# EAGLE design influencair (EAGLE 9.0.1)
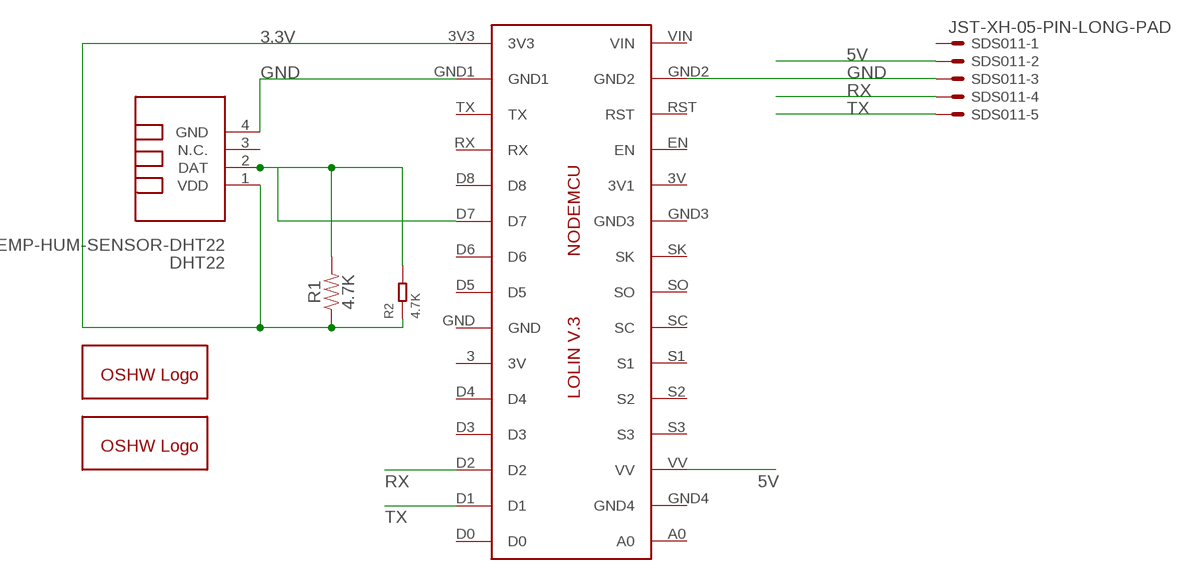
[diagram p0: schematic, sheet 1]

## Parts
DHT22  TEMP-HUM-SENSOR-DHT22  [TEMP-HUM-SENSOR-DHT22]
GOLD_ORB_SM1  OSHWLOGOLOGO8MM  [OSHW_8MM]
GOLD_ORB_SM2  OSHWLOGOLOGO8MM  [OSHW_8MM]
IC1  LOLINV3  [LOLINV3]
R1  4.7K  1MOHM-HORIZ-1/4W-5%  [AXIAL-0.3]
R2  4.7K  SMD-RES-4.7K-5%-1/8W(0805)  [R0805]
SDS011  JST-XH-05-PIN-LONG-PAD  [JST-XH-05-PACKAGE-LONG-PAD]

## Nets
3.3V: DHT22.1(VDD) IC1.3V3 R1.P$1 R2.1
5V: IC1.VV SDS011.2
GND: DHT22.4(GND) IC1.GND1 SDS011.3
N$3: DHT22.2(DAT) IC1.D7 R1.P$2 R2.2
N$4: IC1.GND2
RX: IC1.D2 SDS011.4
TX: IC1.D1 SDS011.5
Unconnected: DHT22.3(N.C.) IC1.3(3V) IC1.3V(3V1) IC1.A0 IC1.D0 IC1.D3 IC1.D4 IC1.D5 IC1.D6 IC1.D8 IC1.EN IC1.GND IC1.GND3 IC1.GND4 IC1.RST IC1.RX IC1.S1 IC1.S2 IC1.S3 IC1.SC IC1.SK IC1.SO IC1.TX IC1.VIN SDS011.1

## Library data of the parts
DHT22 = diy-modules:TEMP-HUM-SENSOR-DHT22: DHT22 - digital humidity & temperature sensor Also known as: AM2302 AM2302 datasheet available here: http://akizukidenshi.com/download/ds/aosong/AM2302.pdf Click here to find device on ebay.com <http://www.ebay.com/sch/dht22+digital+sensor>
GOLD_ORB_SM1 GOLD_ORB_SM2 = oshw:OSHWLOGO: The OSHW logo for PCB layout
IC1 = Lolin:LOLINV3
R1 = SparkFun-Resistors:1MOHM: 1MΩ resistor A resistor is a passive two-terminal electrical component that implements electrical resistance as a circuit element. Resistors act to reduce current flow, and, at the same time, act to lower voltage levels within circuits. - Wikipedia; PROD_ID: RES-09329; VALUE: 1M
R2 = Seeed-Resistor:SMD-RES-4.7K-5%-1/8W(0805): 301010306; MPN: RC0805JR-074K7L
SDS011 = Rembrandt Electronics - JST XH Connectors v1-0:JST-XH-05-PIN: JST XH Connector 2 Pin Wire to board connector. Pitch: 2,54 mm, (0.100") Number of pins: 5 Created by Rembrandt Electronics www.rembrandtelectronics.com

## Board
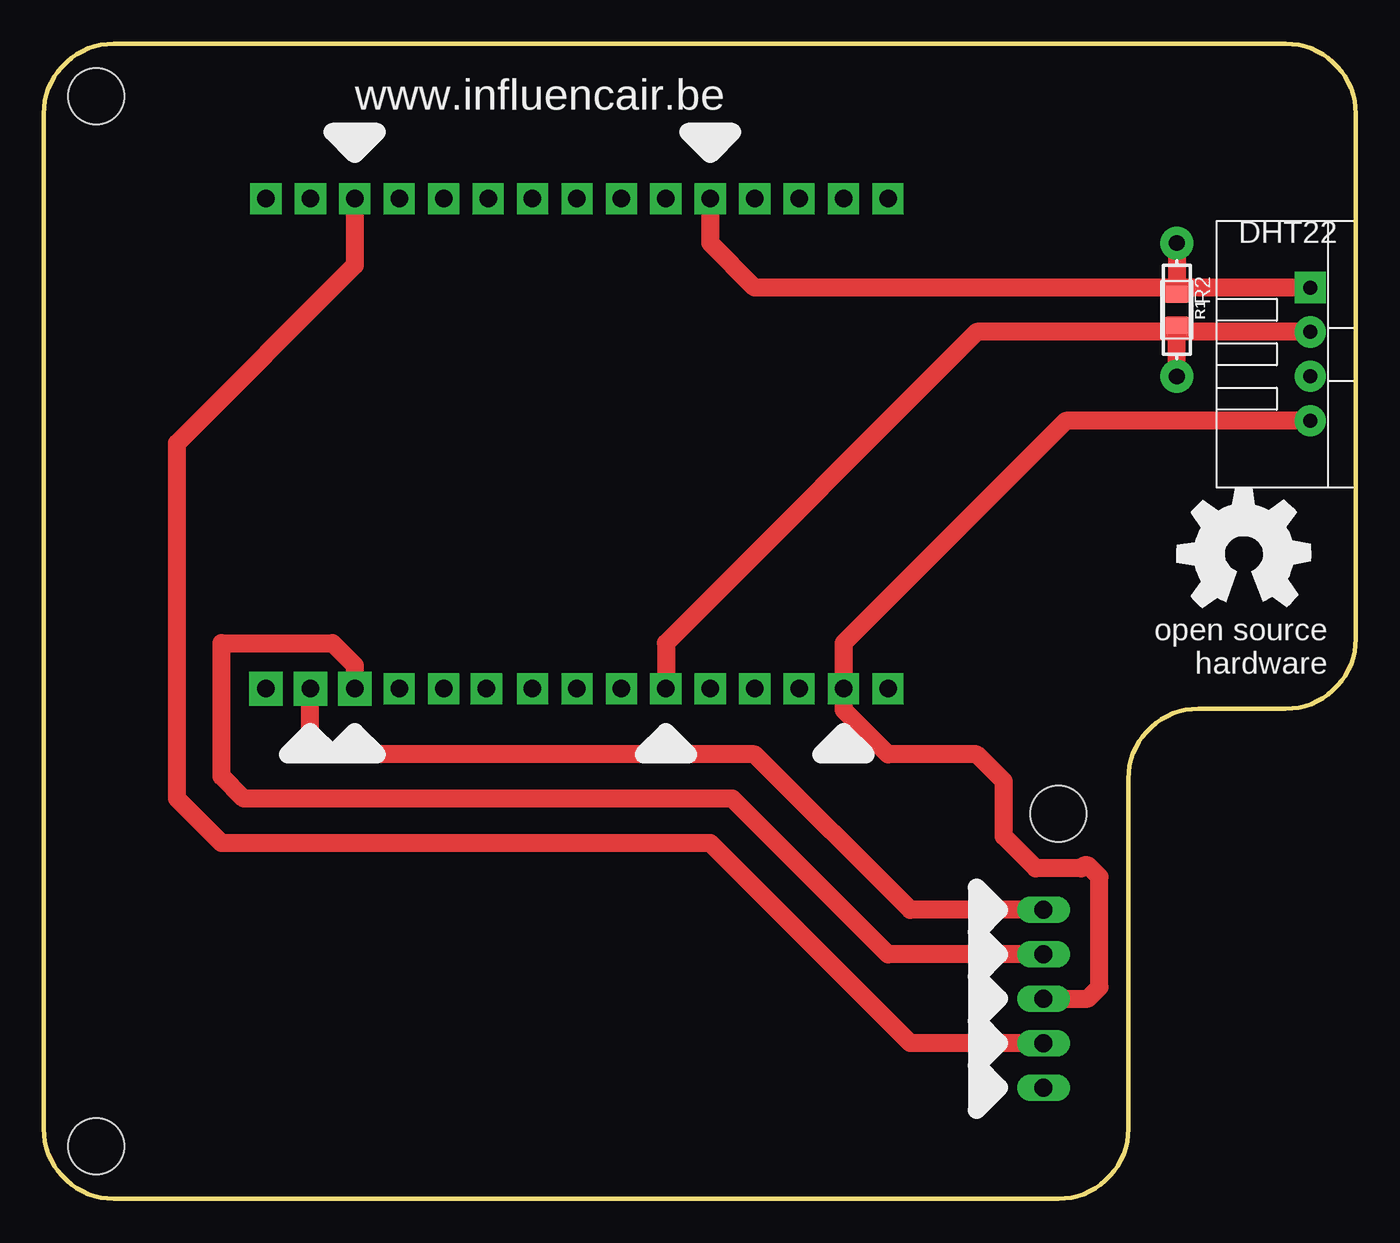
[diagram p1: board, top side]
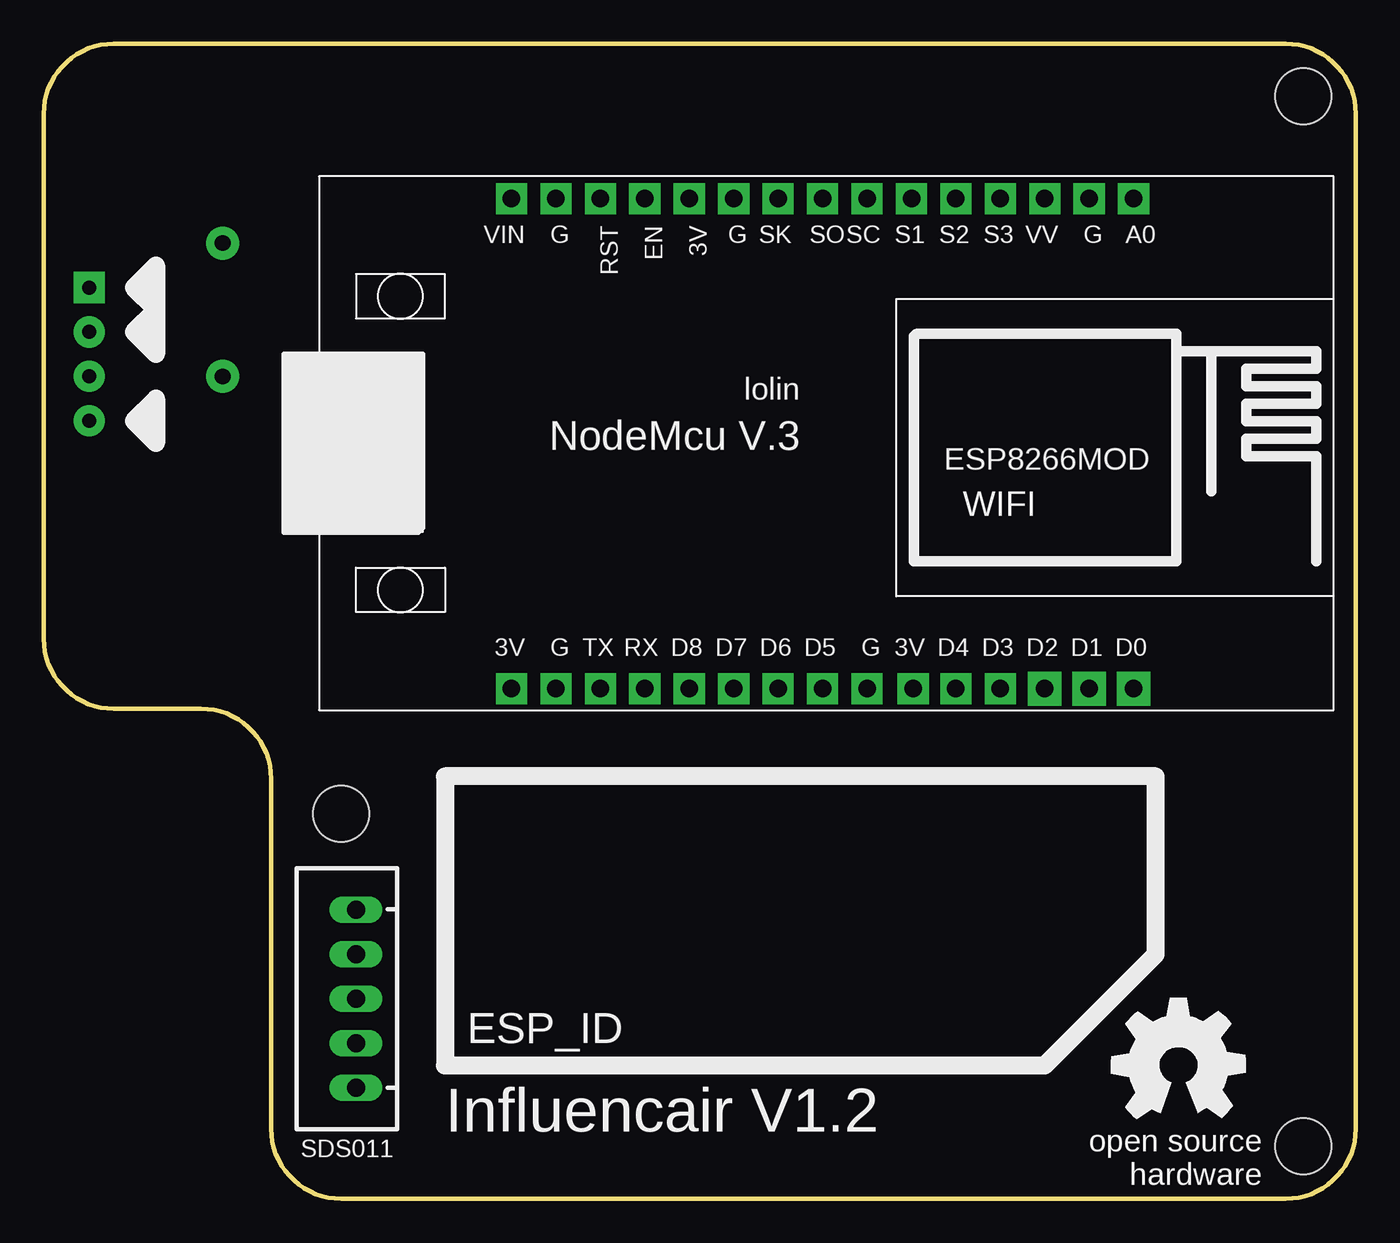
[diagram p2: board, bottom side, seen from below]

Size 75 x 66 mm. Coordinates in mm from the lower left corner, seen from the top.
Outline: 0,4 arc90 4,0 58,0 arc90 62,4 62,24 arc-90 66,28 71,28 arc90 75,32 75,62 arc90 71,66 4,66 arc90 0,62 0,4
Copper layers (1*16): Top 0.035mm / dielectric 1.5mm / Bottom 0.035mm
Design rules "default": minimum track width 6mil, minimum drill 0.35mm, track to track 6mil, track to pad 6mil, pad to pad 6mil, via to via 6mil, smd to smd 6mil, copper to edge 40mil, drill to drill 6mil, minimum pad ring 10mil, minimum via ring 8mil, stop-mask expansion 4mil, vias tented up to drill 0mil, thermal gap 10mil
Holes 3.2 mm at 3,3 58,22 3,63

### Footprints (pad centres in the part's own frame; a part is rotated, then mirrored left to right if it is on the bottom)
TEMP-HUM-SENSOR-DHT22 = drill 0.8 pad 1.778 square: 1 -3.81,0 | drill 0.8 pad 1.778: 2 -1.27,0; 3 1.27,0; 4 3.81,0
LOLINV3 = drill 1 pad 1.778 square: 3 24.03,29.27; 3V 46.99,29.27; 3V3 36.83,1.27; A0 11.43,1.27; D3 19.05,29.27; D4 21.59,29.27; D5 29.21,29.27; D6 31.75,29.27; D7 34.29,29.27; D8 36.83,29.27; EN 39.37,1.27; GND 26.67,29.27; GND1 44.45,29.27; GND2 44.45,1.27; GND3 34.29,1.27; GND4 13.97,1.27; RST 41.91,1.27; RX 39.37,29.27; S1 24.13,1.27; S2 21.59,1.27; S3 19.05,1.27; SC 26.67,1.27; SK 31.75,1.27; SO 29.21,1.27; TX 41.91,29.27; VIN 46.99,1.27; VV 16.51,1.27 | drill 1 pad 1.93 square: D0 11.43,29.27; D1 13.97,29.27; D2 16.51,29.27
AXIAL-0.3 = drill 0.9 pad 1.88: P$1 -3.81,0; P$2 3.81,0
R0805 = smd 1.397 x 1.016: 1 0,0.889; 2 0,-0.889
JST-XH-05-PACKAGE-LONG-PAD = drill 1.016 long: 1 -5.08,0; 2 -2.54,0; 3 0,0; 4 2.54,0; 5 5.08,0

### Placement (x,y rotation side)
DHT22  72.39,48.26 270 top
GOLD_ORB_SM1  68.58,36.83 0 top
GOLD_ORB_SM2  10.16,7.62 0 bottom
IC1  1.27,58.42 180 bottom
R1  64.77,50.8 270 top
R2  64.77,50.8 0 top
SDS011  57.15,11.43 90 bottom

### Tracks (layer width: path | path; a pad name or v marks a point on that pad's centre or on a via)
3.3V
  Top 1.016: DHT22.1 64.77,52.07 | 64.77,52.07 40.64,52.07 38.1,54.61 IC1.3V3 | R1.P$1 64.77,52.07 | R2.1 64.77,52.07
5V
  Top 1.016: SDS011.2 49.53,8.89 38.1,20.32 10.16,20.32 7.62,22.86 7.62,43.18 17.78,53.34 IC1.VV
GND
  Top 1.016: SDS011.3 59.69,11.43 60.35,12.09 60.35,18.39 59.69,19.05 59.47,19.05 59.29,18.88 56.71,18.88 54.88,20.71 54.88,23.86 53.34,25.4 48.26,25.4 45.72,27.94 IC1.GND1 45.72,31.75 58.42,44.45 DHT22.4
N$3
  Top 1.016: DHT22.2 64.77,49.53 | 64.77,49.53 53.34,49.53 35.56,31.75 IC1.D7 | R1.P$2 64.77,49.53 | R2.2 64.77,49.53
RX
  Top 1.016: SDS011.4 48.26,13.97 39.37,22.86 11.43,22.86 10.16,24.13 10.16,31.75 16.51,31.75 17.78,30.48 IC1.D2
TX
  Top 1.016: SDS011.5 49.53,16.51 40.64,25.4 16.51,25.4 15.24,26.67 IC1.D1

### Text on the board
tPlace: www.influencair.be
bPlace: ESP_ID | Influencair V1.2